# Altium schematic sheet AtlasControl-A1.01.01A.SchDoc: ATLAS-CONTROL-A1
size A3; Revision: 01; SheetNumber: 7; SheetTotal: 7
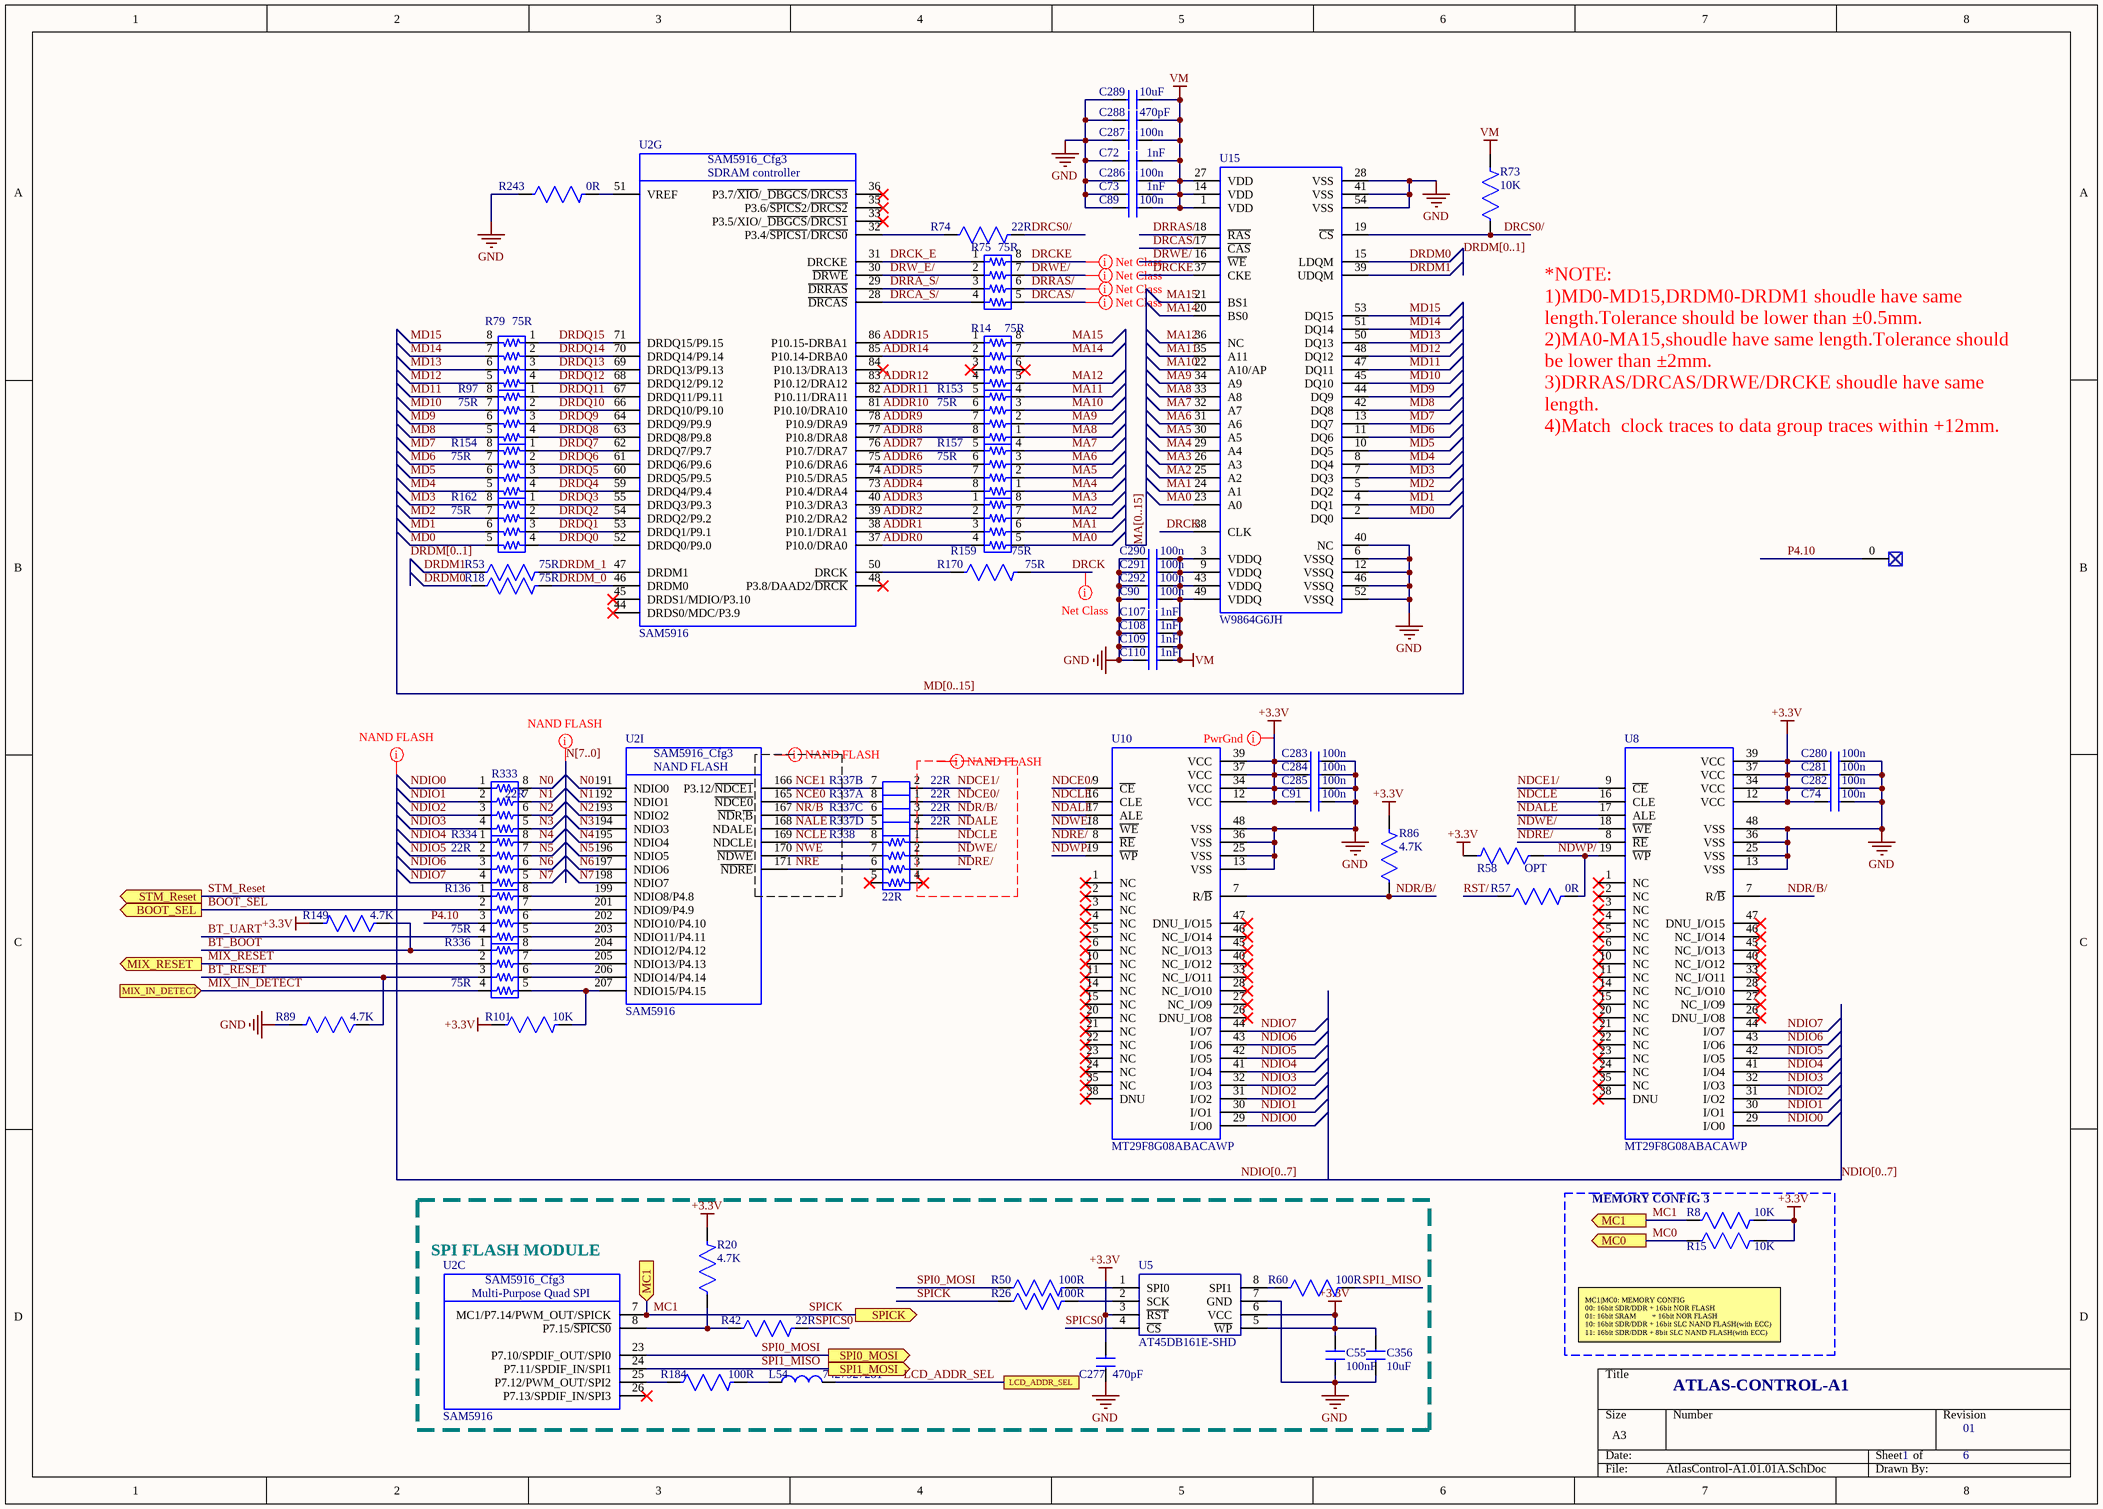
[diagram p0: AtlasControl-A1.01.01A.SchDoc]

## Parts
C55  100nF  [0402]
C72  1nF  [0603]
C73  1nF  [0603]
C74  100n  [0603]
C89  100n  [0603]
C90  100n  [0603]
C91  100n  [0603]
C107  1nF  [0603]
C108  1nF  [0603]
C109  1nF  [0603]
C110  1nF  [0603]
C277  470pF  [0603]
C280  100n  [0603]
C281  100n  [0603]
C282  100n  [0603]
C283  100n  [0603]
C284  100n  [0603]
C285  100n  [0603]
C286  100n  [0603]
C287  100n  [0603]
C288  470pF  [0603]
C289  10uF  [0603]
C290  100n  [0603]
C291  100n  [0603]
C292  100n  [0603]
C356  10uF  [0402]
L54  7427927281  [0402]
P4.10  CON/TestPoints/DIP  [TP2]  (value not drawn)  (no BOM)
R8  10K  [0402]
R14  75R  [YC124]
R15  10K  [0402]
R18  75R  [0402]
R20  4.7K  [0402]
R26  100R  [0402]
R42  22R  [0402]
R50  100R  [0402]
R53  75R  [0402]
R57  0R  [0402]
R58  OPT  [0402]
R60  100R  [0402]
R73  10K  [0603]
R74  22R  [0603]
R75  75R  [YC124]
R79  75R  [YC124]
R86  4.7K  [0402]
R89  4.7K  [0402]
R97  75R  [YC124]
R101  10K  [0402]
R136  75R  [YC124]
R149  4.7K  [0402]
R153  75R  [YC124]
R154  75R  [YC124]
R157  75R  [YC124]
R159  75R  [YC124]
R162  75R  [YC124]
R170  75R  [0402]
R184  100R  [0402]
R243  0R  [0402]
R333  22R  [YC124]
R334  22R  [YC124]
R336  75R  [YC124]
R337  22R  [YC124]  (parts A,B,C,D of 4)
R338  22R  [YC124]
U2  SAM5916  [LQFP216-26X26]  (parts C,G,I of 10)
U5  AT45DB161E-SHD  [SOIC8-208mil]
U8  MT29F8G08ABACAWP  [TSOP48P]
U10  MT29F8G08ABACAWP  [TSOP48P]
U15  W9864G6JH  [TSOP-54L]

## Blocks framed on the sheet
SPI FLASH MODULE: C55 C277 C356 L54 R20 R26 R42 R50 R60 R184 U2 U5
MEMORY CONFIG 3: R8 R15

## Ports
BOOT_SEL (out), LCD_ADDR_SEL, MC0 (out), MC1 (in), MC1 (out), MIX_IN_DETECT (in), MIX_RESET (out), SPI0_MOSI (out), SPI1_MOSI (out), SPICK (out), STM_Reset (out)

## Nets
+3.3V: C55.2 C74.1 C91.1 C277.1 C280.1 C281.1 C282.1 C283.1 C284.1 C285.1 C356.1 R8.2 R15.2 R20.2 R58.2 R86.2 R101.1 R149.2 U5.3(~{RST}) U5.5(~{WP}) U5.6(VCC) U8.12(VCC) U8.34(VCC) U8.37(VCC) U8.39(VCC) U10.12(VCC) U10.34(VCC) U10.37(VCC) U10.39(VCC)
GND: C55.1 C72.1 C73.1 C74.2 C89.1 C90.1 C91.2 C107.1 C108.1 C109.1 C110.1 C277.2 C280.2 C281.2 C282.2 C283.2 C284.2 C285.2 C286.1 C287.1 C288.1 C289.1 C290.1 C291.1 C292.1 C356.2 R89.2 R243.1 U5.7(GND) U8.13(VSS) U8.25(VSS) U8.36(VSS) U8.48(VSS) U10.13(VSS) U10.25(VSS) U10.36(VSS) U10.48(VSS) U15.6(VSSQ) U15.12(VSSQ) U15.28(VSS) U15.40(NC) U15.41(VSS) U15.46(VSSQ) U15.52(VSSQ) U15.54(VSS)
VM: C72.2 C73.2 C89.2 C90.2 C107.2 C108.2 C109.2 C110.2 C286.2 C287.2 C288.2 C289.2 C290.2 C291.2 C292.2 R73.2 U15.1(VDD) U15.3(VDDQ) U15.9(VDDQ) U15.14(VDD) U15.27(VDD) U15.43(VDDQ) U15.49(VDDQ)
ADDR0: R159.4 U2.37(P10.0/DRA0)
ADDR1: R159.3 U2.38(P10.1/DRA1)
ADDR2: R159.2 U2.39(P10.2/DRA2)
ADDR3: R159.1 U2.40(P10.3/DRA3)
ADDR4: R157.8 U2.73(P10.4/DRA4)
ADDR5: R157.7 U2.74(P10.5/DRA5)
ADDR6: R157.6 U2.75(P10.6/DRA6)
ADDR7: R157.5 U2.76(P10.7/DRA7)
ADDR8: R153.8 U2.77(P10.8/DRA8)
ADDR9: R153.7 U2.78(P10.9/DRA9)
ADDR10: R153.6 U2.81(P10.10/DRA10)
ADDR11: R153.5 U2.82(P10.11/DRA11)
ADDR12: R14.4 U2.83(P10.12/DRA12)
ADDR14: R14.2 U2.85(P10.14-DRBA0)
ADDR15: R14.1 U2.86(P10.15-DRBA1)
BOOT_SEL: R136.2 ; port BOOT_SEL
BT_BOOT: R149.1 R336.1
BT_RESET: R89.1 R336.3
BT_UART: R136.4
DRCA_S/: R75.4 U2.28(~{DRCAS})
DRCAS/: R75.5 U15.17(~{CAS})
DRCK: R170.2 U15.38(CLK)
DRCK_E: R75.1 U2.31(DRCKE)
DRCKE: R75.8 U15.37(CKE)
DRCS0/: R73.1 R74.2 U15.19(~{CS})
DRDM0: R18.1 U15.15(LDQM)
DRDM1: R53.1 U15.39(UDQM)
DRDM_0: R18.2 U2.46(DRDM0)
DRDM_1: R53.2 U2.47(DRDM1)
DRDQ0: R162.4 U2.52(DRDQ0/P9.0)
DRDQ1: R162.3 U2.53(DRDQ1/P9.1)
DRDQ2: R162.2 U2.54(DRDQ2/P9.2)
DRDQ3: R162.1 U2.55(DRDQ3/P9.3)
DRDQ4: R154.4 U2.59(DRDQ4/P9.4)
DRDQ5: R154.3 U2.60(DRDQ5/P9.5)
DRDQ6: R154.2 U2.61(DRDQ6/P9.6)
DRDQ7: R154.1 U2.62(DRDQ7/P9.7)
DRDQ8: R97.4 U2.63(DRDQ8/P9.8)
DRDQ9: R97.3 U2.64(DRDQ9/P9.9)
DRDQ10: R97.2 U2.66(DRDQ10/P9.10)
DRDQ11: R97.1 U2.67(DRDQ11/P9.11)
DRDQ12: R79.4 U2.68(DRDQ12/P9.12)
DRDQ13: R79.3 U2.69(DRDQ13/P9.13)
DRDQ14: R79.2 U2.70(DRDQ14/P9.14)
DRDQ15: R79.1 U2.71(DRDQ15/P9.15)
DRRA_S/: R75.3 U2.29(~{DRRAS})
DRRAS/: R75.6 U15.18(~{RAS})
DRW_E/: R75.2 U2.30(~{DRWE})
DRWE/: R75.7 U15.16(~{WE})
LCD_ADDR_SEL: L54.2 ; port LCD_ADDR_SEL
MA0: R159.5 U15.23(A0)
MA1: R159.6 U15.24(A1)
MA2: R159.7 U15.25(A2)
MA3: R159.8 U15.26(A3)
MA4: R157.1 U15.29(A4)
MA5: R157.2 U15.30(A5)
MA6: R157.3 U15.31(A6)
MA7: R157.4 U15.32(A7)
MA8: R153.1 U15.33(A8)
MA9: R153.2 U15.34(A9)
MA10: R153.3 U15.22(A10/AP)
MA11: R153.4 U15.35(A11)
MA12: R14.5 U15.36(NC)
MA14: R14.7 U15.20(BS0)
MA15: R14.8 U15.21(BS1)
MC0: R15.1 ; port MC0
MC1: R8.1 R26.1 U2.7(MC1/P7.14/PWM_OUT/SPICK) ; port MC1, port SPICK  [also labelled SPICK]
MD0: R162.5 U15.2(DQ0)
MD1: R162.6 U15.4(DQ1)
MD2: R162.7 U15.5(DQ2)
MD3: R162.8 U15.7(DQ3)
MD4: R154.5 U15.8(DQ4)
MD5: R154.6 U15.10(DQ5)
MD6: R154.7 U15.11(DQ6)
MD7: R154.8 U15.13(DQ7)
MD8: R97.5 U15.42(DQ8)
MD9: R97.6 U15.44(DQ9)
MD10: R97.7 U15.45(DQ10)
MD11: R97.8 U15.47(DQ11)
MD12: R79.5 U15.48(DQ12)
MD13: R79.6 U15.50(DQ13)
MD14: R79.7 U15.51(DQ14)
MD15: R79.8 U15.53(DQ15)
MIX_IN_DETECT: R336.4 ; port MIX_IN_DETECT
MIX_RESET: R336.2 ; port MIX_RESET
N0: R333.8 U2.191(NDIO0)
N1: R333.7 U2.192(NDIO1)
N2: R333.6 U2.193(NDIO2)
N3: R333.5 U2.194(NDIO3)
N4: R334.8 U2.195(NDIO4)
N5: R334.7 U2.196(NDIO5)
N6: R334.6 U2.197(NDIO6)
N7: R334.5 U2.198(NDIO7)
NALE: R337.5 U2.168(NDALE)
NCE0: R337.8 U2.165(~{NDCE0})
NCE1: R337.7 U2.166(P3.12/~{NDCE1})
NCLE: R338.8 U2.169(NDCLE)
NDALE: R337.4 U8.17(ALE) U10.17(ALE)
NDCE0/: R337.1 U10.9(~{CE})
NDCE1/: R337.2 U8.9(~{CE})
NDCLE: R338.1 U8.16(CLE) U10.16(CLE)
NDIO0: R333.1 U8.29(I/O0) U10.29(I/O0)
NDIO1: R333.2 U8.30(I/O1) U10.30(I/O1)
NDIO2: R333.3 U8.31(I/O2) U10.31(I/O2)
NDIO3: R333.4 U8.32(I/O3) U10.32(I/O3)
NDIO4: R334.1 U8.41(I/O4) U10.41(I/O4)
NDIO5: R334.2 U8.42(I/O5) U10.42(I/O5)
NDIO6: R334.3 U8.43(I/O6) U10.43(I/O6)
NDIO7: R334.4 U8.44(I/O7) U10.44(I/O7)
NDR/B/: R86.1 R337.3 U8.7(R/~{B}) U10.7(R/~{B})
NDRE/: R338.3 U8.8(~{RE}) U10.8(~{RE})
NDWE/: R338.2 U8.18(~{WE}) U10.18(~{WE})
NDWP/: R57.2 R58.1 U8.19(~{WP}) U10.19(~{WP})
NR/B: R337.6 U2.167(~{ND}R~{|B})
NRE: R338.6 U2.171(~{NDRE})
NWE: R338.7 U2.170(~{NDWE})
P4.10: P4.10.0 R136.3
RST/: R57.1
SPI0_MOSI: R50.1 U2.23(P7.10/SPDIF_OUT/SPI0) ; port SPI0_MOSI
SPI1_MISO: R60.2 U2.24(P7.11/SPDIF_IN/SPI1) ; port SPI1_MOSI
SPICS0: R42.2 U5.4(~{CS})
STM_Reset: R136.1 ; port STM_Reset
NetL54_1: L54.1 R184.2
NetR20_1: R20.1 R42.1 U2.8(P7.15/~{SPICS0})
NetR26_2: R26.2 U5.2(SCK)
NetR50_2: R50.2 U5.1(SPI0)
NetR60_1: R60.1 U5.8(SPI1)
NetR74_1: R74.1 U2.32(P3.4/~{SPICS1}/~{DRCS0})
NetR101_2: R101.2 R336.5 U2.207(NDIO15/P4.15)
NetR136_5: R136.5 U2.203(NDIO11/P4.11)
NetR136_6: R136.6 U2.202(NDIO10/P4.10)
NetR136_7: R136.7 U2.201(NDIO9/P4.9)
NetR136_8: R136.8 U2.199(NDIO8/P4.8)
NetR170_1: R170.1 U2.50(DRCK)
NetR184_1: R184.1 U2.25(P7.12/PWM_OUT/SPI2)
NetR243_2: R243.2 U2.51(VREF)
NetR336_6: R336.6 U2.206(NDIO14/P4.14)
NetR336_7: R336.7 U2.205(NDIO13/P4.13)
NetR336_8: R336.8 U2.204(NDIO12/P4.12)

Not connected (* = marked no-connect by the designer): R14 3* 6*; R338 4* 5*; U2 26(P7.13/SPDIF_IN/SPI3)* 33(P3.5/XIO/_~{DBGCS}/~{DRCS1})* 35(P3.6/~{SPICS}2/~{DRCS2})* 36(P3.7/~{XIO}/_~{DBGCS}/~{DRCS3})* 44(DRDS0/MDC/P3.9)* 45(DRDS1/MDIO/P3.10)* 48(P3.8/DAAD2/~{DRCK})* 84(P10.13/DRA13)*; U8 1(NC)* 2(NC)* 3(NC)* 4(NC)* 5(NC)* 6(NC)* 10(NC)* 11(NC)* 14(NC)* 15(NC)* 20(NC)* 21(NC)* 22(NC)* 23(NC)* 24(NC)* 26(DNU_I/O8)* 27(NC_I/O9)* 28(NC_I/O10)* 33(NC_I/O11)* 35(NC)* 38(DNU)* 40(NC_I/O12)* 45(NC_I/O13)* 46(NC_I/O14)* 47(DNU_I/O15)*; U10 1(NC)* 2(NC)* 3(NC)* 4(NC)* 5(NC)* 6(NC)* 10(NC)* 11(NC)* 14(NC)* 15(NC)* 20(NC)* 21(NC)* 22(NC)* 23(NC)* 24(NC)* 26(DNU_I/O8)* 27(NC_I/O9)* 28(NC_I/O10)* 33(NC_I/O11)* 35(NC)* 38(DNU)* 40(NC_I/O12)* 45(NC_I/O13)* 46(NC_I/O14)* 47(DNU_I/O15)*

## Buses and harness runs
bus DRDM[0..1]
bus MA[0..15]
bus MD[0..15]
bus N[7..0]
bus NDIO[0..7]

## Layout directives
net class SDRAM_Control Command: DRCAS/, DRCKE, DRRAS/, DRWE/
net class DR: DRCK
net class PwrGnd: +3.3V
net class NAND FLASH: (no net found under the mark), NALE, NCE0, NCE1, NCLE, NDALE, NDCE0/, NDCE1/, NDCLE, NDR/B/, NDRE/, NDWE/, NR/B, NRE, NWE

## Notes on the sheet
- *NOTE:
  1)MD0-MD15,DRDM0-DRDM1 shoudle have same length.Tolerance should be lower than ±0.5mm.
  2)MA0-MA15,shoudle have same length.Tolerance should be lower than ±2mm.
  3)DRRAS/DRCAS/DRWE/DRCKE shoudle have same length.
  4)Match  clock traces to data group traces within +12mm.
- MC1|MC0: MEMORY CONFIG
  00: 16bit SDR/DDR + 16bit NOR FLASH
  01: 16bit SRAM        + 16bit NOR FLASH
  10: 16bit SDR/DDR + 16bit SLC NAND FLASH(with ECC)
  11: 16bit SDR/DDR + 8bit SLC NAND FLASH(with ECC)
- 1
- 6
- (in symbol IC/CPU/SAM5916_CFG3/LQFP216, part C) SAM5916_Cfg3; Multi-Purpose Quad SPI
- (in symbol IC/CPU/SAM5916_CFG3/LQFP216, part G) SAM5916_Cfg3; SDRAM controller
- (in symbol IC/CPU/SAM5916_CFG3/LQFP216, part I) SAM5916_Cfg3; NAND FLASH

## Library data of the parts
C55 = CAP/CE/0402/50V/100NF/10%: 贴片电容100n(ROHS); MANUFACTURER: 上海博奥电子有限公司; PART NUMBER: 417A; *CRLF**: cost"; MODEL: C0402-100n-50V-10%-X7R; Tolerance: 10%; Voltage Rating: 50V; PKG TYPE: 0402; VALUE: 100nF
C72 C73 C107-C110 = CAP/CE/0603/50V/1NF/5%: 贴片电容1n(ROHS); MANUFACTURER: 上海博奥电子有限公司; PART NUMBER: 1560; *CRLF**: cost"; MODEL: C0603-1n-50V-5％; Tolerance: 10%; Voltage Rating: 50V; Manufacturer #2: *; PKG TYPE: 0603; VALUE: 1nF
C74 C89-C91 C280-C287 C290-C292 = CAP/CE/0603/50V/100NF/10%: 贴片电容100n(ROHS); MANUFACTURER: 上海博奥电子有限公司; PART NUMBER: A1578; *CRLF**: cost"; MODEL: CL10B104KB8NNNC; Tolerance: 10%; Voltage Rating: 50V; PKG TYPE: 0603; VALUE: 100n
C277 C288 = CAP/CE/0603/50V/470PF/5%: 贴片电容470p(ROHS); MANUFACTURER: 上海博奥电子有限公司; PART NUMBER: 1566; *CRLF**: cost"; MODEL: C0603-470p-50V-5％; Tolerance: 5%; Voltage Rating: 50V; Manufacturer #2: *; PKG TYPE: 0603; VALUE: 470pF
C289 = CAP/CE/0603/16V/10UF/10%: 贴片电容10u(ROHS); MANUFACTURER: 上海博奥电子有限公司; PART NUMBER: B1500; MODEL: C0603-10u-16V-10％; Tolerance: 10%; Voltage Rating: 16V; PKG TYPE: 0603; VALUE: 10uF
C356 = CAP/CE/0402/10V/10uF/20%: 贴片电容10u(ROHS); MANUFACTURER: 上海博奥电子有限公司; PART NUMBER: B1522; *CRLF**: cost"; MODEL: C0402-10u-10V-20%-X5R; Tolerance: 20%; Voltage Rating: 10V; PKG TYPE: 0402; VALUE: 10uF
L54 = IND/7427927281/0402: 贴片磁珠; MANUFACTURER: 伍尔特(天津)电子有限公司; PART NUMBER: 13786; *CRLF**: Cost"; Manufacturer #2: *; MODEL: 7427927281; PKG TYPE: 0402; VALUE: 7427927281
P4.10 = CON/TestPoints/DIP: TEST; Cost: *
R8 R15 R101 = RES/CE/0402/10K/1%: 贴片电阻10K; MANUFACTURER: 上海博奥电子有限公司; PART NUMBER: A308; *CRLF**: cost"; MODEL: R0402-10K-1/16W-1%; PKG TYPE: 0402; VALUE: 10K
R14 R75 R79 R97 R136 R153 R154 R157 R159 R162 R336 = RES/CE/YC124/75R/5%: 贴片排阻75R(ROHS); MANUFACTURER: 上海博奥电子有限公司; PART NUMBER: D104; *CRLF**: cost"; MODEL: 4D02WGJ0750TCE; Manufacturer #2: *; Value: 75R
R18 R53 R170 = RES/CE/0402/75R/1%: 贴片电阻75R(ROHS); MANUFACTURER: uniohm; PART NUMBER: D353; *CRLF**: cost"; MODEL: R0402-75R-1/16W-1%; PKG TYPE: 0402; VALUE: 75R
R20 R86 R89 R149 = RES/CE/0402/4.7K/1%: 贴片电阻4.7K; MANUFACTURER: 深圳市万联芯科技有限公司; PART NUMBER: A316; MODEL: R0402-4.7K-1/16W-1%; PKG TYPE: 0402; VALUE: 4.7K
R26 R50 R60 R184 = RES/CE/0402/100R/1%: 贴片电阻100R; MANUFACTURER: 上海博奥电子有限公司; PART NUMBER: A313; *CRLF**: cost"; MODEL: R0402-100R-1/16W-1%; PKG TYPE: 0402; VALUE: 100R
R42 = RES/CE/0402/22R/1%: 贴片电阻22R; MANUFACTURER: 上海博奥电子有限公司; PART NUMBER: A315; *CRLF**: cost"; MODEL: R0402-22R-1/16W-1%; PKG TYPE: 0402; VALUE: 22R
R57 R243 = RES/CE/0402/0R/1%: 贴片电阻0R; MANUFACTURER: 深圳市万联芯科技有限公司; PART NUMBER: A317; MODEL: R0402-0R-1/16W-1%; PKG TYPE: 0402; VALUE: 0R
R58 = RES/CE/0402/0R/5%: 贴片电阻0R(ROHS); MANUFACTURER: 上海博奥电子有限公司; PART NUMBER: B376; *CRLF**: cost"; MODEL: R0402-0R-1/16W-5%; PKG TYPE: 0402; VALUE: OPT
R73 = RES/CE/0603/10K/5%: 贴片电阻10K(ROHS); MANUFACTURER: 上海博奥电子有限公司; PART NUMBER: 374; *CRLF**: cost"; MODEL: R0603-10K-1/10W-5％; PKG TYPE: 0603; VALUE: 10K
R74 = RES/CE/0603/22R/5%: 贴片电阻22R(ROHS); MANUFACTURER: 上海博奥电子有限公司; PART NUMBER: 336; *CRLF**: cost"; MODEL: R0603-22R-1/10W-5％; PKG TYPE: 0603; VALUE: 22R
R333 R334 R338 = RES/CE/YC124/22R/1%: 贴片排阻22R(ROHS); MANUFACTURER: 上海博奥电子有限公司; PART NUMBER: C128; *CRLF**: cost"; MODEL: 4D02WGJ022TCE; Manufacturer #2: *; Value: 22R
R337 = RES/CE/YC124/22R/1%_1: 贴片排阻22R(ROHS); MANUFACTURER: 上海博奥电子有限公司; PART NUMBER: C128; *CRLF**: cost"; MODEL: 4D02WGJ022TCE; Manufacturer #2: *; Value: 22R
U2 = IC/CPU/SAM5916_CFG3/LQFP216: 音源; Model: SAM5916/LQFP216; PCB DECAL: LQFP216; Value: SAM5916
U5 = IC/FLASH/AT45DB081E-SHN: 8M-bit串行flash; Part Number: 4965; Information: IC,Flash,3V,8M BIT,; Model: AT45DB081E-SHN-B; Verify: No; ComponentLink1Description: Datasheet; Value: AT45DB161E-SHD
U8 U10 = IC/FLASH/MT29F8G08ABACAWP/TSOP48P: NAND FLASH; PART NUMBER: 4968; MODEL: MT29F8G08ABACAWP-IT:C/TSOP48; Value: MT29F8G08ABACAWP
U15 = IC/SDRAM/W9864G6JH/TSOP-54L: SDRAM; PART NUMBER: 4329; MODEL: W9864G6KH-6/TSOP-54L; Value: W9864G6JH